# Altium schematic sheet Button.SchDoc
size A4
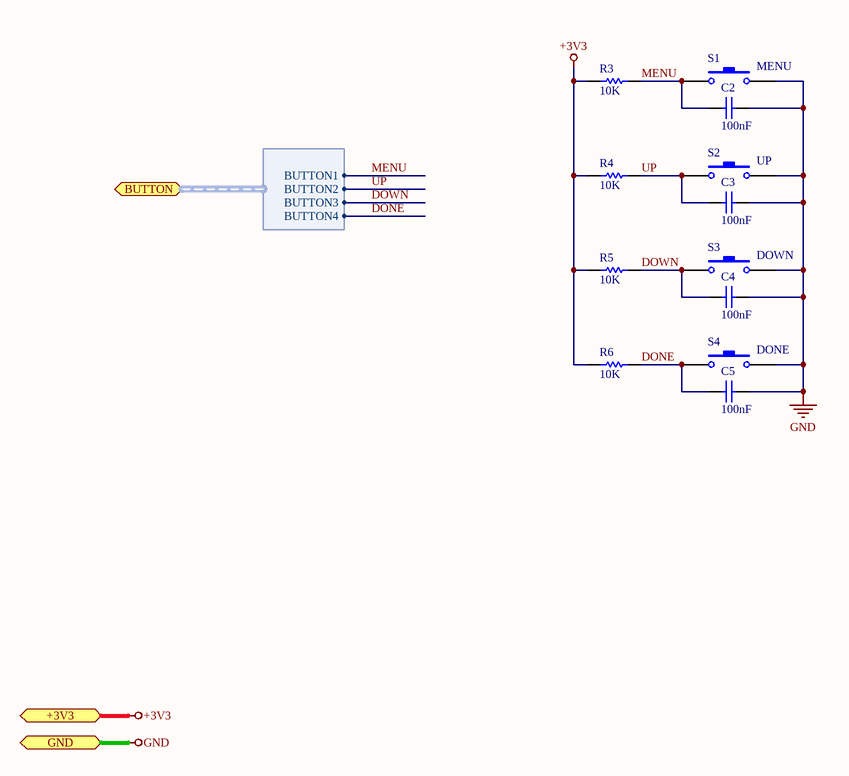
[diagram p0: Button.SchDoc]

## Parts
C2  value 100nF  [C-0805]  (hidden comment: 104)
C3  value 100nF  [C-0805]  (hidden comment: 104)
C4  value 100nF  [C-0805]  (hidden comment: 104)
C5  value 100nF  [C-0805]  (hidden comment: 104)
R3  10K  [R-0805]
R4  10K  [R-0805]
R5  10K  [R-0805]
R6  10K  [R-0805]
S1  value MENU  [SW-T-S12]  (hidden comment: SW-T-S12)
S2  value UP  [SW-T-S12]  (hidden comment: SW-T-S12)
S3  value DOWN  [SW-T-S12]  (hidden comment: SW-T-S12)
S4  value DONE  [SW-T-S12]  (hidden comment: SW-T-S12)

## Ports
+3V3, BUTTON (harness BUTTON), GND

## Harnesses
BUTTON: BUTTON1, BUTTON2, BUTTON3, BUTTON4

## Nets
+3V3: R3.2 R4.2 R5.2 R6.2 ; port +3V3
GND: C2.2 C3.2 C4.2 C5.2 S1.2 S2.2 S3.2 S4.2 ; port GND
DONE: C5.1 R6.1 S4.1 ; port BUTTON.BUTTON4
DOWN: C4.1 R5.1 S3.1 ; port BUTTON.BUTTON3
MENU: C2.1 R3.1 S1.1 ; port BUTTON.BUTTON1
UP: C3.1 R4.1 S2.1 ; port BUTTON.BUTTON2

## Library data of the parts
C2-C5 = Cap: Capacitor; Published: 8-Jun-2000; LatestRevisionDate: 17-Jul-2002; LatestRevisionNote: Re-released for DXP Platform.; PackageReference: RAD-0.3; Publisher: Altium Limited
R3-R6 = Res1: Resistor; Published: 8-Jun-2000; LatestRevisionDate: 17-Jul-2002; LatestRevisionNote: Re-released for DXP Platform.; PackageReference: AXIAL-0.3; Publisher: Altium Limited; PackageDescription: Axial Device, Thru-Hole; 2 Leads; 0.3 in Pin Spacing; Value: 10K
S1-S4 = SW-PB: Switch; Published: 24-Mar-1999; LatestRevisionDate: 17-Jul-2002; LatestRevisionNote: Re-released for DXP Platform.; PackageReference: SPST-2; PackageDescription: Switch; 2 Leads